# Altium schematic sheet Video OUT.SchDoc: Video OUT
size A4; Organization: Altium Limited; Address1: L3, 12a Rodborough Rd; Address2: Frenchs Forest; Address3: NSW; Address4: Australia 2086; Revision: 1; SheetNumber: 9; SheetTotal: 11; Alumno: Diego Caceres; Curso: R1051; Materia: Sistemas de Representación; Docentes: Ing. Perdomo, Ing. Fuoco, Ing. Giorno, Sr. Vergili
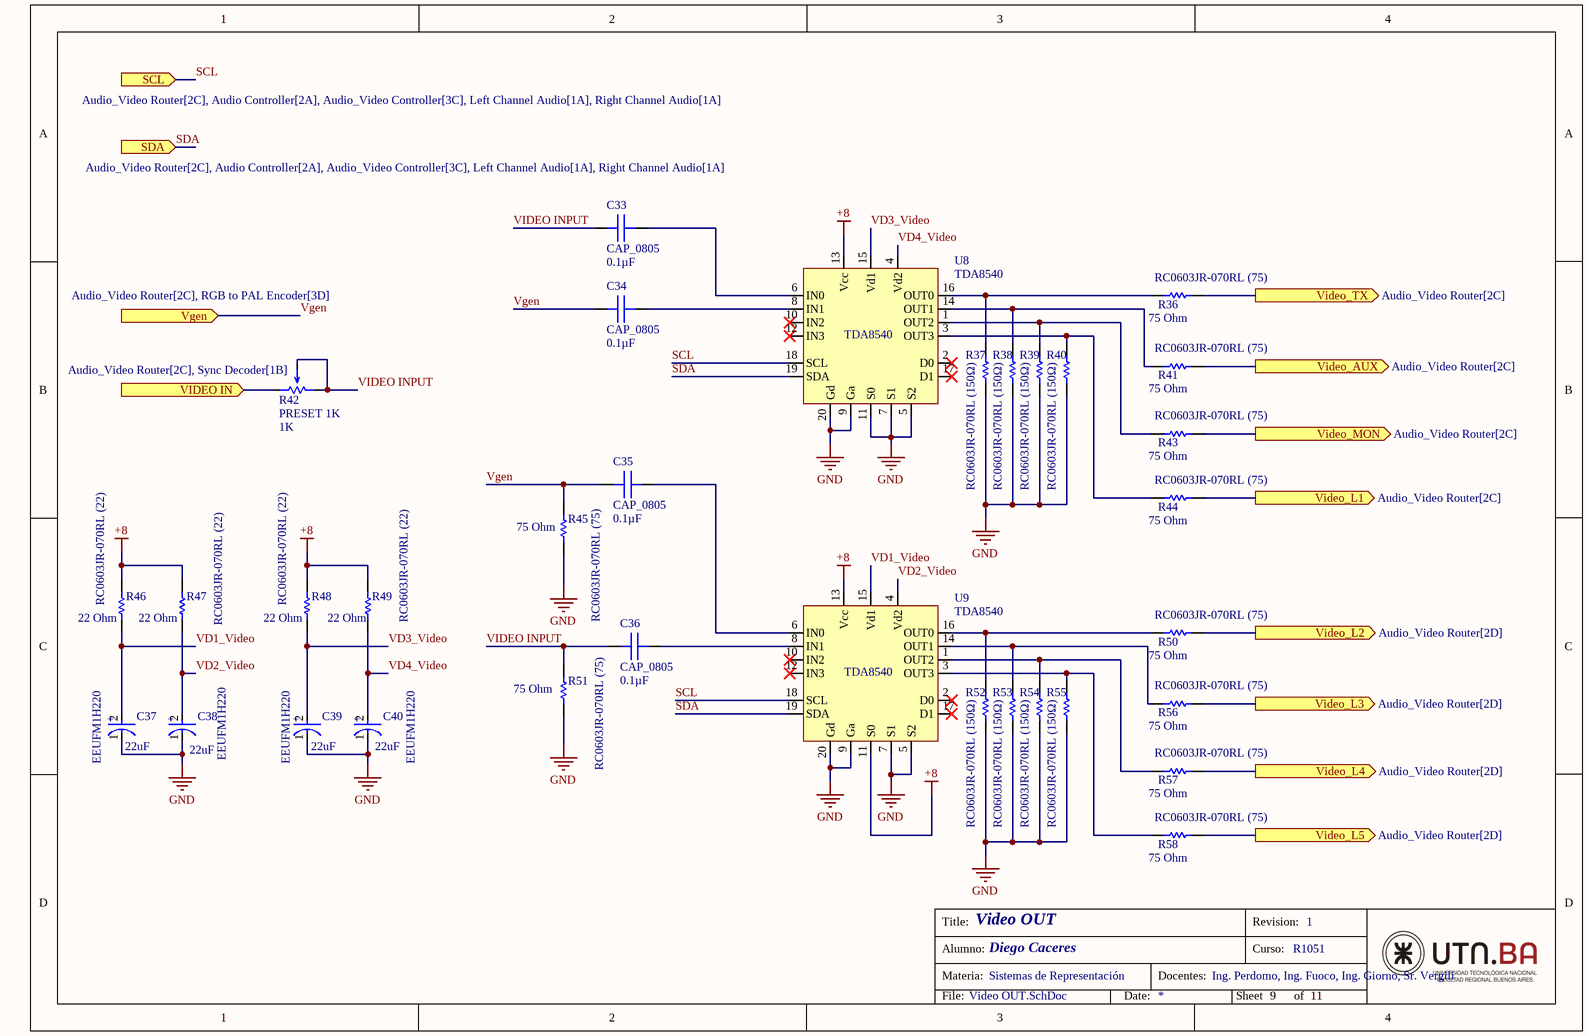
[diagram p0: Video OUT.SchDoc]

## Parts
C33  CAP_0805  value 0.1µF  [0805_CAPACITOR_DCACERES]
C34  CAP_0805  value 0.1µF  [0805_CAPACITOR_DCACERES]
C35  CAP_0805  value 0.1µF  [0805_CAPACITOR_DCACERES]
C36  CAP_0805  value 0.1µF  [0805_CAPACITOR_DCACERES]
C37  EEUFM1H220  Capacitance: 22uF  [FP-RAD-TH-D_5_0_5-L_11_1-MFG]
C38  EEUFM1H220  Capacitance: 22uF  [FP-RAD-TH-D_5_0_5-L_11_1-MFG]
C39  EEUFM1H220  Capacitance: 22uF  [FP-RAD-TH-D_5_0_5-L_11_1-MFG]
C40  EEUFM1H220  Capacitance: 22uF  [FP-RAD-TH-D_5_0_5-L_11_1-MFG]
R36  RC0603JR-070RL (75)  Resistance: 75 Ohm  [RESC1608X55X25ML10T15]
R37  RC0603JR-070RL (150Ω)  [RESC1608X55X25ML10T15]
R38  RC0603JR-070RL (150Ω)  [RESC1608X55X25ML10T15]
R39  RC0603JR-070RL (150Ω)  [RESC1608X55X25ML10T15]
R40  RC0603JR-070RL (150Ω)  [RESC1608X55X25ML10T15]
R41  RC0603JR-070RL (75)  Resistance: 75 Ohm  [RESC1608X55X25ML10T15]
R42  PRESET 1K  value 1K  [3386P_PRESET_1K_DCaceres]
R43  RC0603JR-070RL (75)  Resistance: 75 Ohm  [RESC1608X55X25ML10T15]
R44  RC0603JR-070RL (75)  Resistance: 75 Ohm  [RESC1608X55X25ML10T15]
R45  RC0603JR-070RL (75)  Resistance: 75 Ohm  [RESC1608X55X25ML10T15]
R46  RC0603JR-070RL (22)  Resistance: 22 Ohm  [RESC1608X55X25ML10T15]
R47  RC0603JR-070RL (22)  Resistance: 22 Ohm  [RESC1608X55X25ML10T15]
R48  RC0603JR-070RL (22)  Resistance: 22 Ohm  [RESC1608X55X25ML10T15]
R49  RC0603JR-070RL (22)  Resistance: 22 Ohm  [RESC1608X55X25ML10T15]
R50  RC0603JR-070RL (75)  Resistance: 75 Ohm  [RESC1608X55X25ML10T15]
R51  RC0603JR-070RL (75)  Resistance: 75 Ohm  [RESC1608X55X25ML10T15]
R52  RC0603JR-070RL (150Ω)  [RESC1608X55X25ML10T15]
R53  RC0603JR-070RL (150Ω)  [RESC1608X55X25ML10T15]
R54  RC0603JR-070RL (150Ω)  [RESC1608X55X25ML10T15]
R55  RC0603JR-070RL (150Ω)  [RESC1608X55X25ML10T15]
R56  RC0603JR-070RL (75)  Resistance: 75 Ohm  [RESC1608X55X25ML10T15]
R57  RC0603JR-070RL (75)  Resistance: 75 Ohm  [RESC1608X55X25ML10T15]
R58  RC0603JR-070RL (75)  Resistance: 75 Ohm  [RESC1608X55X25ML10T15]
U8  TDA8540  [SOT146-1_DIP20_TDA8540_DCACERES]
U9  TDA8540  [SOT146-1_DIP20_TDA8540_DCACERES]

## Ports
SCL (in, see Audio_Video Router[2C], Audio Controller[2A], Audio_Video Controller[3C], Left Channel Audio[1A], Right Channel Audio[1A]), SDA (in, see Audio_Video Router[2C], Audio Controller[2A], Audio_Video Controller[3C], Left Channel Audio[1A], Right Channel Audio[1A]), Vgen (in, see Audio_Video Router[2C], RGB to PAL Encoder[3D]), VIDEO IN (in, see Audio_Video Router[2C], Sync Decoder[1B]), Video_AUX (out, see Audio_Video Router[2C]), Video_L1 (out, see Audio_Video Router[2C]), Video_L2 (out, see Audio_Video Router[2D]), Video_L3 (out, see Audio_Video Router[2D]), Video_L4 (out, see Audio_Video Router[2D]), Video_L5 (out, see Audio_Video Router[2D]), Video_MON (out, see Audio_Video Router[2C]), Video_TX (out, see Audio_Video Router[2C])

## Nets
+8: R46.2 R47.2 R48.2 R49.2 U8.13(Vcc) U9.11(S0) U9.13(Vcc)
GND: C37.1(C) C38.1(C) C39.1(C) C40.1(C) R37.2 R38.2 R39.2 R40.2 R45.1 R51.1 R52.2 R53.2 R54.2 R55.2 U8.5(S2) U8.7(S1) U8.9(Ga) U8.11(S0) U8.20(Gd) U9.5(S2) U9.7(S1) U9.9(Ga) U9.20(Gd)
SCL: U8.18(SCL) U9.18(SCL) ; port SCL
SDA: U8.19(SDA) U9.19(SDA) ; port SDA
VD1_Video: C37.2(A) R46.1 U9.15(Vd1)
VD2_Video: C38.2(A) R47.1 U9.4(Vd2)
VD3_Video: C39.2(A) R48.1 U8.15(Vd1)
VD4_Video: C40.2(A) R49.1 U8.4(Vd2)
Vgen: C34.1 C35.1 R45.2 ; port Vgen
VIDEO IN: R42.2 ; port VIDEO IN
VIDEO INPUT: C33.1 C36.1 R42.1 R42.3 R51.2
Video_AUX: R41.2 ; port Video_AUX
Video_L1: R44.2 ; port Video_L1
Video_L2: R50.2 ; port Video_L2
Video_L3: R56.2 ; port Video_L3
Video_L4: R57.2 ; port Video_L4
Video_L5: R58.2 ; port Video_L5
Video_MON: R43.2 ; port Video_MON
Video_TX: R36.2 ; port Video_TX
NetC33_2: C33.2 U8.6(IN0)
NetC34_2: C34.2 U8.8(IN1)
NetC35_2: C35.2 U9.6(IN0)
NetC36_2: C36.2 U9.8(IN1)
NetR36_1: R36.1 R37.1 U8.16(OUT0)
NetR38_1: R38.1 R41.1 U8.14(OUT1)
NetR39_1: R39.1 R43.1 U8.1(OUT2)
NetR40_1: R40.1 R44.1 U8.3(OUT3)
NetR50_1: R50.1 R52.1 U9.16(OUT0)
NetR53_1: R53.1 R56.1 U9.14(OUT1)
NetR54_1: R54.1 R57.1 U9.1(OUT2)
NetR55_1: R55.1 R58.1 U9.3(OUT3)

Not connected (* = marked no-connect by the designer): U8 2(D0)* 10(IN2)* 12(IN3)* 17(D1)*; U9 2(D0)* 10(IN2)* 12(IN3)* 17(D1)*

## Notes on the sheet
- Title:
- Revision:
- Alumno:
- Materia:
- Docentes:
- Curso:
- File:
- Date:
- Sheet
- of
- (in symbol CMP-05427-000661-1) +

## Library data of the parts
C33-C36 = CAPACITOR_0805_Caceres: Capacitor SMD, encapsulado 0805; SizePackage: 0805; ComponentLink1Description: Datasheet1; ComponentLink1URL: https://www.mouser.com/datasheet/2/40/AutoMLCCKAM-3216307.pdf; ComponentLink2Description: Datasheet2; ComponentLink2URL: https://www.mouser.com/datasheet/2/447/KEM_C1086_U2J-3316409.pdf; ComponentLink3Description: Datasheet3; ComponentLink3URL: https://product.tdk.com/system/files/dam/doc/product/capacitor/ceramic/mlcc/catalog/mlcc_commercial_soft_en.pdf
C37-C40 = CMP-05427-000661-1: Aluminum Electrolytic Capacitors (Radial Lead Type) 22uF ±20% 50V; Impedance: 340mR; Life (Hours): 2000Hour; Dissipation Factor: 0.1%; Ripple Current: 250mA; Lead Diameter: 0.5mm; REACH SVHC: No SVHC; Tolerance: 20%; Max Operating Temperature: 105°C; RoHS Compliant: Yes; Height - Seated (Max): 0.492inch; Number of Pins: 2; Case/Package: Radial; Series: FM; ESR (Equivalent Series Resistance): 340mR; Length: 11mm; Radiation Hardening: No; Voltage: 50V; Min Operating Temperature: -40°C; Voltage Rating: 50V; Voltage Rating (DC): 50V; Lead Free: Lead Free; Package Quantity: 200; Lead Pitch: 2mm; Height: 11mm; Mount: Through Hole; Construction: RADIAL; Termination: Radial; Diameter: 5mm; Packaging: Bulk
R36 R41 R43-R51 R56-R58 = CMP-2100-03667-1: Chip Resistor, 0 Ohm, +/- 5%, 0.1 W, -55 to 155 degC, 0603 (1608 Metric), RoHS, Tape and Reel; Manufacturer: Yageo; Temperature Coefficient: 200ppm/degreesC; Voltage Rating: 50V; Power Rating: 100mW; Width: 0.8mm; Max Operating Temperature: 155degC; Tolerance: 5%; Package Reference: 0603; Height: 0.45mm; Depth: 0.8mm; Package Description: 2-Pin Surface Mount Device, Body 1.6 x 0.8 mm; Termination: SMD/SMT; Package Quantity: 5000; Case/Package: 0603; Case Code (Imperial): 0603; Radiation Hardening: No; Number of Pins: 2; Length: 1.6mm; Lead Free: LeadFree; Voltage Rating (DC): 50V; Military Standard: Not; Datasheet URL: http://www.yageo.com/NewPortal/yageodocoutput?fileName=/pdf/R-Chip/PYu-RC_Group_51_RoHS_L_5.pdf; Manufacturer URL: http://www.yageo.com/; Packaging: TapeandReel; Case Code (Metric): 1608; Min Operating Temperature: -55degC; Composition: ThickFilm; RoHSCompliant: true; Contact Plating: Tin; Datasheet Version: Rev. 5, 10/2016; REACH SVHC: NoSVHC
R37-R40 R52-R55 = CMP-2100-03667-1: Chip Resistor, 0 Ohm, +/- 5%, 0.1 W, -55 to 155 degC, 0603 (1608 Metric), RoHS, Tape and Reel; Manufacturer: Yageo; Temperature Coefficient: 200ppm/degreesC; Voltage Rating: 50V; Power Rating: 100mW; Resistance: 150 Ohm; Width: 0.8mm; Max Operating Temperature: 155degC; Tolerance: 5%; Package Reference: 0603; Height: 0.45mm; Depth: 0.8mm; Package Description: 2-Pin Surface Mount Device, Body 1.6 x 0.8 mm; Termination: SMD/SMT; Package Quantity: 5000; Case/Package: 0603; Case Code (Imperial): 0603; Radiation Hardening: No; Number of Pins: 2; Length: 1.6mm; Lead Free: LeadFree; Voltage Rating (DC): 50V; Military Standard: Not; Datasheet URL: http://www.yageo.com/NewPortal/yageodocoutput?fileName=/pdf/R-Chip/PYu-RC_Group_51_RoHS_L_5.pdf; Manufacturer URL: http://www.yageo.com/; Packaging: TapeandReel; Case Code (Metric): 1608; Min Operating Temperature: -55degC; Composition: ThickFilm; RoHSCompliant: true; Contact Plating: Tin; Datasheet Version: Rev. 5, 10/2016; REACH SVHC: NoSVHC
R42 = Preset_1K_Caceres: Preset 1k, Thru Hole / Manufacturer Part Search 3386P-1-472LF; PartNumber: 3386P-1-472LF; ComponentLink1Description: Package Specification; ComponentLink1URL: https://ar.mouser.com/datasheet/2/54/3386-776606.pdf; ComponentLink2Description: URL Link; ComponentLink2URL: https://www.mouser.com/ProductDetail/Bourns/3386P-1-472LF?qs=g1MxsQ5vwlSvqan31esVSg%3D%3D
U8 U9 = TDA8540_Caceres: TDA8540, Thtu Hole / Plastic dual in-line package; 20 leads (300 mil); DIP20; SOT146-1.; ComponentLink1Description: Datasheet; ComponentLink1URL: https://pdf1.alldatasheet.es/datasheet-pdf/view/19499/PHILIPS/TDA8540.html; ComponentLink2Description: URL Link; ComponentLink2URL: https://www.nxp.com/products/no-longer-manufactured/tda8540t:TDA8540T; ComponentLink3Description: Discontinuation Notice; ComponentLink3URL: https://www.nxp.com/wcm_documents/products/eol/dn46exha.pdf; ComponentLink4Description: Package Specification; ComponentLink4URL: https://html.alldatasheet.es/html-pdf/19499/PHILIPS/TDA8540/3258/13/TDA8540.html; PartNumber: TDA8540; PackageReference: DIP20; Status: Discontinued